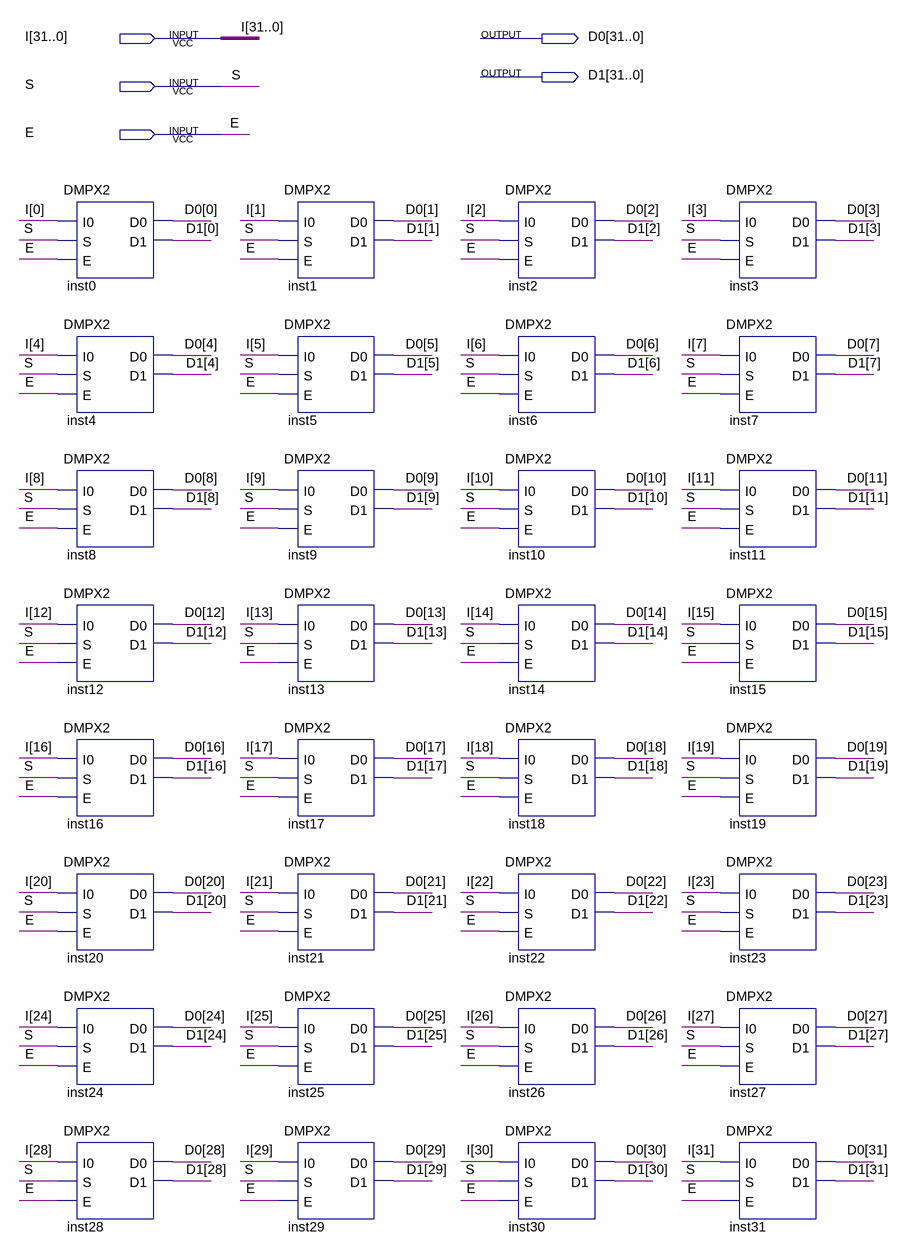
[diagram p0: schematic sheet]
// Quartus schematic DMPX2_32BIT.bdf as structural Verilog: 32 symbols, 5 pins
module DMPX2_32BIT (
  input  [31:0] I,
  input  S,
  input  E,
  output [31:0] D0,
  output [31:0] D1
);

  DMPX2 inst0 (.I0(I[0]), .S(S), .E(E), .D0(D0[0]), .D1(D1[0]));
  DMPX2 inst4 (.I0(I[4]), .S(S), .E(E), .D0(D0[4]), .D1(D1[4]));
  DMPX2 inst8 (.I0(I[8]), .S(S), .E(E), .D0(D0[8]), .D1(D1[8]));
  DMPX2 inst12 (.I0(I[12]), .S(S), .E(E), .D0(D0[12]), .D1(D1[12]));
  DMPX2 inst16 (.I0(I[16]), .S(S), .E(E), .D0(D0[16]), .D1(D1[16]));
  DMPX2 inst20 (.I0(I[20]), .S(S), .E(E), .D0(D0[20]), .D1(D1[20]));
  DMPX2 inst24 (.I0(I[24]), .S(S), .E(E), .D0(D0[24]), .D1(D1[24]));
  DMPX2 inst28 (.I0(I[28]), .S(S), .E(E), .D0(D0[28]), .D1(D1[28]));
  DMPX2 inst1 (.I0(I[1]), .S(S), .E(E), .D0(D0[1]), .D1(D1[1]));
  DMPX2 inst5 (.I0(I[5]), .S(S), .E(E), .D0(D0[5]), .D1(D1[5]));
  DMPX2 inst9 (.I0(I[9]), .S(S), .E(E), .D0(D0[9]), .D1(D1[9]));
  DMPX2 inst13 (.I0(I[13]), .S(S), .E(E), .D0(D0[13]), .D1(D1[13]));
  DMPX2 inst17 (.I0(I[17]), .S(S), .E(E), .D0(D0[17]), .D1(D1[17]));
  DMPX2 inst21 (.I0(I[21]), .S(S), .E(E), .D0(D0[21]), .D1(D1[21]));
  DMPX2 inst25 (.I0(I[25]), .S(S), .E(E), .D0(D0[25]), .D1(D1[25]));
  DMPX2 inst29 (.I0(I[29]), .S(S), .E(E), .D0(D0[29]), .D1(D1[29]));
  DMPX2 inst2 (.I0(I[2]), .S(S), .E(E), .D0(D0[2]), .D1(D1[2]));
  DMPX2 inst6 (.I0(I[6]), .S(S), .E(E), .D0(D0[6]), .D1(D1[6]));
  DMPX2 inst10 (.I0(I[10]), .S(S), .E(E), .D0(D0[10]), .D1(D1[10]));
  DMPX2 inst14 (.I0(I[14]), .S(S), .E(E), .D0(D0[14]), .D1(D1[14]));
  DMPX2 inst18 (.I0(I[18]), .S(S), .E(E), .D0(D0[18]), .D1(D1[18]));
  DMPX2 inst22 (.I0(I[22]), .S(S), .E(E), .D0(D0[22]), .D1(D1[22]));
  DMPX2 inst26 (.I0(I[26]), .S(S), .E(E), .D0(D0[26]), .D1(D1[26]));
  DMPX2 inst30 (.I0(I[30]), .S(S), .E(E), .D0(D0[30]), .D1(D1[30]));
  DMPX2 inst3 (.I0(I[3]), .S(S), .E(E), .D0(D0[3]), .D1(D1[3]));
  DMPX2 inst7 (.I0(I[7]), .S(S), .E(E), .D0(D0[7]), .D1(D1[7]));
  DMPX2 inst11 (.I0(I[11]), .S(S), .E(E), .D0(D0[11]), .D1(D1[11]));
  DMPX2 inst15 (.I0(I[15]), .S(S), .E(E), .D0(D0[15]), .D1(D1[15]));
  DMPX2 inst19 (.I0(I[19]), .S(S), .E(E), .D0(D0[19]), .D1(D1[19]));
  DMPX2 inst23 (.I0(I[23]), .S(S), .E(E), .D0(D0[23]), .D1(D1[23]));
  DMPX2 inst27 (.I0(I[27]), .S(S), .E(E), .D0(D0[27]), .D1(D1[27]));
  DMPX2 inst31 (.I0(I[31]), .S(S), .E(E), .D0(D0[31]), .D1(D1[31]));
endmodule
